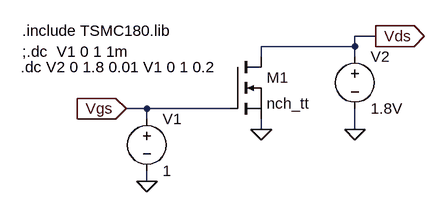
[diagram p0: schematic Prob_4a.asc]
Prob_4a.asc, the LTspice schematic file:
Version 4
SHEET 1 928 680
WIRE 400 64 368 64
WIRE 368 80 368 64
WIRE 368 80 224 80
WIRE 224 96 224 80
WIRE 368 96 368 80
WIRE 48 176 16 176
WIRE 176 176 48 176
WIRE 48 192 48 176
WIRE 224 208 224 192
WIRE 368 208 368 176
WIRE 48 288 48 272
FLAG 48 288 0
FLAG 224 208 0
FLAG 368 208 0
FLAG 16 176 Vgs
IOPIN 16 176 In
FLAG 400 64 Vds
IOPIN 400 64 Out
SYMBOL nmos 176 96 R0
SYMATTR InstName M1
SYMATTR Value nch_tt
SYMBOL voltage 48 176 R0
WINDOW 123 0 0 Left 0
WINDOW 39 0 0 Left 0
SYMATTR InstName V1
SYMATTR Value 1
SYMBOL voltage 368 80 R0
WINDOW 123 0 0 Left 0
WINDOW 39 0 0 Left 0
SYMATTR InstName V2
SYMATTR Value 1.8V
TEXT -144 56 Left 2 !.include TSMC180.lib
TEXT -146 112 Left 2 !.dc V2 0 1.8 0.01 V1 0 1 0.2
TEXT -144 88 Left 2 !;.dc  V1 0 1 1m

The netlist it stands for:
* Prob_4a.asc
M1 Vds Vgs 0 0 nch_tt
V1 Vgs 0 1
V2 Vds 0 1.8V
.model NMOS NMOS
.model PMOS PMOS
.lib standard.mos
.include TSMC180.lib
.dc V2 0 1.8 0.01 V1 0 1 0.2
;.dc  V1 0 1 1m
.backanno
.end